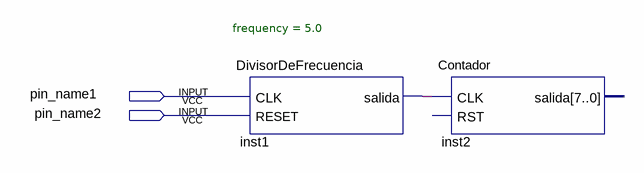
[diagram p0: schematic sheet]
// Quartus schematic Practica4.bdf as structural Verilog: 2 symbols, 2 pins
module Practica4 (
  input  pin_name1,
  input  pin_name2
);

  wire inst1_salida;

  DivisorDeFrecuencia #(.frequency(5.0)) inst1 (.CLK(pin_name1), .RESET(pin_name2), .salida(inst1_salida));
  Contador inst2 (.CLK(inst1_salida));  // open: RST, salida
endmodule
